# Altium schematic sheet PHOTODIODE (CONT).SchDoc
size 420 x 297 mm; SheetNumber: 6; SheetTotal: 6
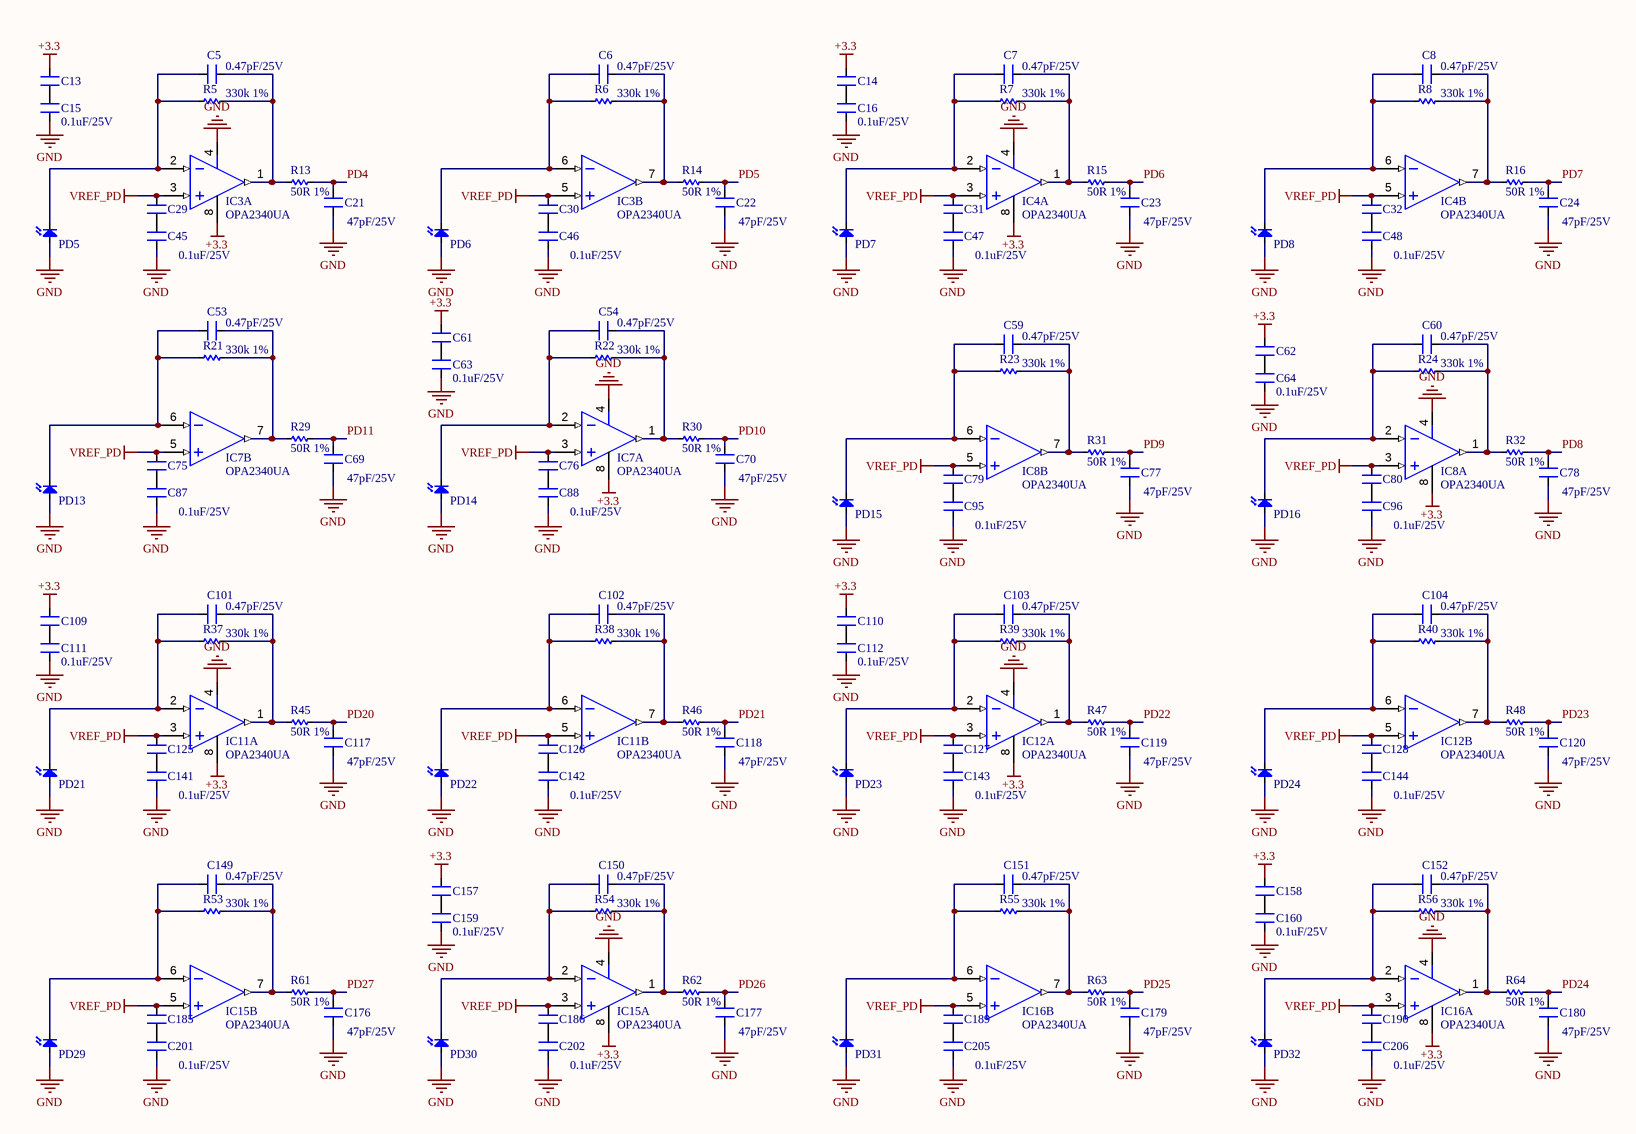
[diagram p0: PHOTODIODE (CONT).SchDoc]

## Parts
C5  0.47pF/25V  [SM-0603]
C6  0.47pF/25V  [SM-0603]
C7  0.47pF/25V  [SM-0603]
C8  0.47pF/25V  [SM-0603]
C13  0.1uF/25V  [SM-0603]  (value not drawn)
C14  0.1uF/25V  [SM-0603]  (value not drawn)
C15  0.1uF/25V  [SM-0603]
C16  0.1uF/25V  [SM-0603]
C21  47pF/25V  [SM-0603]
C22  47pF/25V  [SM-0603]
C23  47pF/25V  [SM-0603]
C24  47pF/25V  [SM-0603]
C29  0.1uF/25V  [SM-0603]
C30  0.1uF/25V  [SM-0603]
C31  0.1uF/25V  [SM-0603]
C32  0.1uF/25V  [SM-0603]
C45  0.1uF/25V  [SM-0603]  (value not drawn)
C46  0.1uF/25V  [SM-0603]  (value not drawn)
C47  0.1uF/25V  [SM-0603]  (value not drawn)
C48  0.1uF/25V  [SM-0603]  (value not drawn)
C53  0.47pF/25V  [SM-0603]
C54  0.47pF/25V  [SM-0603]
C59  0.47pF/25V  [SM-0603]
C60  0.47pF/25V  [SM-0603]
C61  0.1uF/25V  [SM-0603]  (value not drawn)
C62  0.1uF/25V  [SM-0603]  (value not drawn)
C63  0.1uF/25V  [SM-0603]
C64  0.1uF/25V  [SM-0603]
C69  47pF/25V  [SM-0603]
C70  47pF/25V  [SM-0603]
C75  0.1uF/25V  [SM-0603]
C76  0.1uF/25V  [SM-0603]
C77  47pF/25V  [SM-0603]
C78  47pF/25V  [SM-0603]
C79  0.1uF/25V  [SM-0603]
C80  0.1uF/25V  [SM-0603]
C87  0.1uF/25V  [SM-0603]  (value not drawn)
C88  0.1uF/25V  [SM-0603]  (value not drawn)
C95  0.1uF/25V  [SM-0603]  (value not drawn)
C96  0.1uF/25V  [SM-0603]  (value not drawn)
C101  0.47pF/25V  [SM-0603]
C102  0.47pF/25V  [SM-0603]
C103  0.47pF/25V  [SM-0603]
C104  0.47pF/25V  [SM-0603]
C109  0.1uF/25V  [SM-0603]  (value not drawn)
C110  0.1uF/25V  [SM-0603]  (value not drawn)
C111  0.1uF/25V  [SM-0603]
C112  0.1uF/25V  [SM-0603]
C117  47pF/25V  [SM-0603]
C118  47pF/25V  [SM-0603]
C119  47pF/25V  [SM-0603]
C120  47pF/25V  [SM-0603]
C125  0.1uF/25V  [SM-0603]
C126  0.1uF/25V  [SM-0603]
C127  0.1uF/25V  [SM-0603]
C128  0.1uF/25V  [SM-0603]
C141  0.1uF/25V  [SM-0603]  (value not drawn)
C142  0.1uF/25V  [SM-0603]  (value not drawn)
C143  0.1uF/25V  [SM-0603]  (value not drawn)
C144  0.1uF/25V  [SM-0603]  (value not drawn)
C149  0.47pF/25V  [SM-0603]
C150  0.47pF/25V  [SM-0603]
C151  0.47pF/25V  [SM-0603]
C152  0.47pF/25V  [SM-0603]
C157  0.1uF/25V  [SM-0603]  (value not drawn)
C158  0.1uF/25V  [SM-0603]  (value not drawn)
C159  0.1uF/25V  [SM-0603]
C160  0.1uF/25V  [SM-0603]
C176  47pF/25V  [SM-0603]
C177  47pF/25V  [SM-0603]
C179  47pF/25V  [SM-0603]
C180  47pF/25V  [SM-0603]
C185  0.1uF/25V  [SM-0603]
C186  0.1uF/25V  [SM-0603]
C189  0.1uF/25V  [SM-0603]
C190  0.1uF/25V  [SM-0603]
C201  0.1uF/25V  [SM-0603]  (value not drawn)
C202  0.1uF/25V  [SM-0603]  (value not drawn)
C205  0.1uF/25V  [SM-0603]  (value not drawn)
C206  0.1uF/25V  [SM-0603]  (value not drawn)
IC3  OPA2340UA  [SO8]  (parts A,B of 2)
IC4  OPA2340UA  [SO8]  (parts A,B of 2)
IC7  OPA2340UA  [SO8]  (parts A,B of 2)
IC8  OPA2340UA  [SO8]  (parts A,B of 2)
IC11  OPA2340UA  [SO8]  (parts A,B of 2)
IC12  OPA2340UA  [SO8]  (parts A,B of 2)
IC15  OPA2340UA  [SO8]  (parts A,B of 2)
IC16  OPA2340UA  [SO8]  (parts A,B of 2)
PD5  Photodiode  [SFH2240]  (value not drawn)
PD6  Photodiode  [SFH2240]  (value not drawn)
PD7  Photodiode  [SFH2240]  (value not drawn)
PD8  Photodiode  [SFH2240]  (value not drawn)
PD13  Photodiode  [SFH2240]  (value not drawn)
PD14  Photodiode  [SFH2240]  (value not drawn)
PD15  Photodiode  [SFH2240]  (value not drawn)
PD16  Photodiode  [SFH2240]  (value not drawn)
PD21  Photodiode  [SFH2240]  (value not drawn)
PD22  Photodiode  [SFH2240]  (value not drawn)
PD23  Photodiode  [SFH2240]  (value not drawn)
PD24  Photodiode  [SFH2240]  (value not drawn)
PD29  Photodiode  [SFH2240]  (value not drawn)
PD30  Photodiode  [SFH2240]  (value not drawn)
PD31  Photodiode  [SFH2240]  (value not drawn)
PD32  Photodiode  [SFH2240]  (value not drawn)
R5  330k 1%  [RES-SMD-0603]
R6  330k 1%  [RES-SMD-0603]
R7  330k 1%  [RES-SMD-0603]
R8  330k 1%  [RES-SMD-0603]
R13  50R 1%  [RES-SMD-0603]
R14  50R 1%  [RES-SMD-0603]
R15  50R 1%  [RES-SMD-0603]
R16  50R 1%  [RES-SMD-0603]
R21  330k 1%  [RES-SMD-0603]
R22  330k 1%  [RES-SMD-0603]
R23  330k 1%  [RES-SMD-0603]
R24  330k 1%  [RES-SMD-0603]
R29  50R 1%  [RES-SMD-0603]
R30  50R 1%  [RES-SMD-0603]
R31  50R 1%  [RES-SMD-0603]
R32  50R 1%  [RES-SMD-0603]
R37  330k 1%  [RES-SMD-0603]
R38  330k 1%  [RES-SMD-0603]
R39  330k 1%  [RES-SMD-0603]
R40  330k 1%  [RES-SMD-0603]
R45  50R 1%  [RES-SMD-0603]
R46  50R 1%  [RES-SMD-0603]
R47  50R 1%  [RES-SMD-0603]
R48  50R 1%  [RES-SMD-0603]
R53  330k 1%  [RES-SMD-0603]
R54  330k 1%  [RES-SMD-0603]
R55  330k 1%  [RES-SMD-0603]
R56  330k 1%  [RES-SMD-0603]
R61  50R 1%  [RES-SMD-0603]
R62  50R 1%  [RES-SMD-0603]
R63  50R 1%  [RES-SMD-0603]
R64  50R 1%  [RES-SMD-0603]

## Nets
+3.3: C13.2 C14.2 C61.2 C62.2 C109.2 C110.2 C157.2 C158.2 IC3.8(+V) IC4.8(+V) IC7.8(+V) IC8.8(+V) IC11.8(+V) IC12.8(+V) IC15.8(+V) IC16.8(+V)
GND: C15.1 C16.1 C21.1 C22.1 C23.1 C24.1 C45.1 C46.1 C47.1 C48.1 C63.1 C64.1 C69.1 C70.1 C77.1 C78.1 C87.1 C88.1 C95.1 C96.1 C111.1 C112.1 C117.1 C118.1 C119.1 C120.1 C141.1 C142.1 C143.1 C144.1 C159.1 C160.1 C176.1 C177.1 C179.1 C180.1 C201.1 C202.1 C205.1 C206.1 IC3.4(-V) IC4.4(-V) IC7.4(-V) IC8.4(-V) IC11.4(-V) IC12.4(-V) IC15.4(-V) IC16.4(-V) PD5.1(A) PD6.1(A) PD7.1(A) PD8.1(A) PD13.1(A) PD14.1(A) PD15.1(A) PD16.1(A) PD21.1(A) PD22.1(A) PD23.1(A) PD24.1(A) PD29.1(A) PD30.1(A) PD31.1(A) PD32.1(A)
VREF_PD: C29.2 C30.2 C31.2 C32.2 C75.2 C76.2 C79.2 C80.2 C125.2 C126.2 C127.2 C128.2 C185.2 C186.2 C189.2 C190.2 IC3.3(IN+) IC3.5(IN+) IC4.3(IN+) IC4.5(IN+) IC7.3(IN+) IC7.5(IN+) IC8.3(IN+) IC8.5(IN+) IC11.3(IN+) IC11.5(IN+) IC12.3(IN+) IC12.5(IN+) IC15.3(IN+) IC15.5(IN+) IC16.3(IN+) IC16.5(IN+)
PD4: C21.2 R13.2
PD5: C22.2 R14.2
PD6: C23.2 R15.2
PD7: C24.2 R16.2
PD8: C78.2 R32.2
PD9: C77.2 R31.2
PD10: C70.2 R30.2
PD11: C69.2 R29.2
PD20: C117.2 R45.2
PD21: C118.2 R46.2
PD22: C119.2 R47.2
PD23: C120.2 R48.2
PD24: C180.2 R64.2
PD25: C179.2 R63.2
PD26: C177.2 R62.2
PD27: C176.2 R61.2
NetC5_1: C5.1 IC3.2(IN-) PD5.2(K) R5.1
NetC5_2: C5.2 IC3.1(OUT) R5.2 R13.1
NetC6_1: C6.1 IC3.6(IN-) PD6.2(K) R6.1
NetC6_2: C6.2 IC3.7(OUT) R6.2 R14.1
NetC7_1: C7.1 IC4.2(IN-) PD7.2(K) R7.1
NetC7_2: C7.2 IC4.1(OUT) R7.2 R15.1
NetC8_1: C8.1 IC4.6(IN-) PD8.2(K) R8.1
NetC8_2: C8.2 IC4.7(OUT) R8.2 R16.1
NetC13_1: C13.1 C15.2
NetC14_1: C14.1 C16.2
NetC29_1: C29.1 C45.2
NetC30_1: C30.1 C46.2
NetC31_1: C31.1 C47.2
NetC32_1: C32.1 C48.2
NetC53_1: C53.1 IC7.6(IN-) PD13.2(K) R21.1
NetC53_2: C53.2 IC7.7(OUT) R21.2 R29.1
NetC54_1: C54.1 IC7.2(IN-) PD14.2(K) R22.1
NetC54_2: C54.2 IC7.1(OUT) R22.2 R30.1
NetC59_1: C59.1 IC8.6(IN-) PD15.2(K) R23.1
NetC59_2: C59.2 IC8.7(OUT) R23.2 R31.1
NetC60_1: C60.1 IC8.2(IN-) PD16.2(K) R24.1
NetC60_2: C60.2 IC8.1(OUT) R24.2 R32.1
NetC61_1: C61.1 C63.2
NetC62_1: C62.1 C64.2
NetC75_1: C75.1 C87.2
NetC76_1: C76.1 C88.2
NetC79_1: C79.1 C95.2
NetC80_1: C80.1 C96.2
NetC101_1: C101.1 IC11.2(IN-) PD21.2(K) R37.1
NetC101_2: C101.2 IC11.1(OUT) R37.2 R45.1
NetC102_1: C102.1 IC11.6(IN-) PD22.2(K) R38.1
NetC102_2: C102.2 IC11.7(OUT) R38.2 R46.1
NetC103_1: C103.1 IC12.2(IN-) PD23.2(K) R39.1
NetC103_2: C103.2 IC12.1(OUT) R39.2 R47.1
NetC104_1: C104.1 IC12.6(IN-) PD24.2(K) R40.1
NetC104_2: C104.2 IC12.7(OUT) R40.2 R48.1
NetC109_1: C109.1 C111.2
NetC110_1: C110.1 C112.2
NetC125_1: C125.1 C141.2
NetC126_1: C126.1 C142.2
NetC127_1: C127.1 C143.2
NetC128_1: C128.1 C144.2
NetC149_1: C149.1 IC15.6(IN-) PD29.2(K) R53.1
NetC149_2: C149.2 IC15.7(OUT) R53.2 R61.1
NetC150_1: C150.1 IC15.2(IN-) PD30.2(K) R54.1
NetC150_2: C150.2 IC15.1(OUT) R54.2 R62.1
NetC151_1: C151.1 IC16.6(IN-) PD31.2(K) R55.1
NetC151_2: C151.2 IC16.7(OUT) R55.2 R63.1
NetC152_1: C152.1 IC16.2(IN-) PD32.2(K) R56.1
NetC152_2: C152.2 IC16.1(OUT) R56.2 R64.1
NetC157_1: C157.1 C159.2
NetC158_1: C158.1 C160.2
NetC185_1: C185.1 C201.2
NetC186_1: C186.1 C202.2
NetC189_1: C189.1 C205.2
NetC190_1: C190.1 C206.2

## Notes on the sheet
- Project:
- BEE-PC1
- Sub-system:
- Design by:
- Hung Nguyen D.
- Bao Bui Q.
- Sheet title:
- Sheet
- A3
- of
- Checked by:
- Approved by:
- Vu Pham
- Revision:
- Document No:
- V1.0.0
- Size:
- Date:

## Library data of the parts
C5-C8 C13-C16 C21-C24 C29-C32 C45-C48 C53 C54 C59-C64 C69 C70 C75-C80 C87 C88 C95 C96 C101-C104 C109-C112 C117-C120 C125-C128 C141-C144 C149-C152 C157-C160 C176 C177 C179 C180 C185 C186 C189 C190 C201 C202 C205 C206 = CM: 0603; Value: 103
IC3 IC4 IC7 IC8 IC11 IC12 IC15 IC16 = LM358: 8SOIC; Value: LM358
R5-R8 R13-R16 R21-R24 R29-R32 R37-R40 R45-R48 R53-R56 R61-R64 = Res-SMD: 0603; Manufacturer: Generic Components; Class: Passive; Published: 08/06/2000; Publisher: Altium Hobart Technology Centre